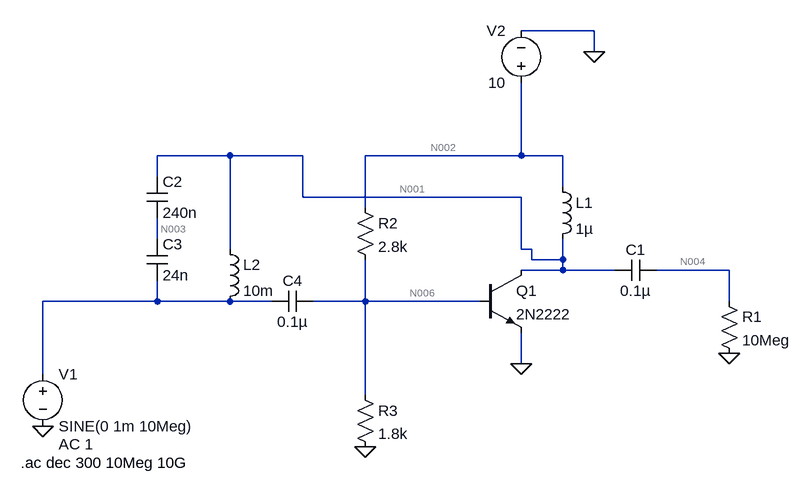
[diagram p0: schematic Draft11.asc]
Draft11.asc, the LTspice schematic file:
Version 4
SHEET 1 880 680
WIRE 336 -144 224 -144
WIRE 336 -112 336 -144
WIRE -224 48 -336 48
WIRE -112 48 -224 48
WIRE 224 48 224 -64
WIRE 224 48 -16 48
WIRE 288 48 224 48
WIRE -336 80 -336 48
WIRE 288 96 288 48
WIRE -112 112 -112 48
WIRE 224 112 -112 112
WIRE -16 128 -16 48
WIRE -336 176 -336 144
WIRE -224 192 -224 48
WIRE 224 192 224 112
WIRE 240 192 224 192
WIRE 240 208 240 192
WIRE 288 208 288 176
WIRE 288 208 240 208
WIRE 288 224 288 208
WIRE 288 224 224 224
WIRE 368 224 288 224
WIRE 544 224 432 224
WIRE -336 272 -336 240
WIRE -336 272 -512 272
WIRE -224 272 -336 272
WIRE -160 272 -224 272
WIRE -16 272 -16 208
WIRE -16 272 -96 272
WIRE 160 272 -16 272
WIRE 544 272 544 224
WIRE 224 368 224 320
WIRE -512 384 -512 272
WIRE -16 416 -16 272
FLAG 224 368 0
FLAG 544 352 0
FLAG -16 496 0
FLAG -512 464 0
FLAG 336 -112 0
SYMBOL ind 272 80 R0
SYMATTR InstName L1
SYMATTR Value 1µ
SYMBOL cap 432 208 R90
WINDOW 0 0 32 VBottom 2
WINDOW 3 32 32 VTop 2
SYMATTR InstName C1
SYMATTR Value 0.1µ
SYMBOL npn 160 224 R0
SYMATTR InstName Q1
SYMATTR Value 2N2222
SYMBOL res 528 256 R0
SYMATTR InstName R1
SYMATTR Value 10Meg
SYMBOL res -32 112 R0
SYMATTR InstName R2
SYMATTR Value 2.8k
SYMBOL res -32 400 R0
SYMATTR InstName R3
SYMATTR Value 1.8k
SYMBOL ind -240 176 R0
SYMATTR InstName L2
SYMATTR Value 10m
SYMBOL voltage -512 368 R0
WINDOW 123 24 124 Left 2
WINDOW 39 0 0 Left 0
SYMATTR InstName V1
SYMATTR Value SINE(0 1m 10Meg)
SYMATTR Value2 AC 1
SYMBOL voltage 224 -48 R180
WINDOW 0 24 96 Left 2
WINDOW 3 24 16 Left 2
WINDOW 123 0 0 Left 0
WINDOW 39 0 0 Left 0
SYMATTR InstName V2
SYMATTR Value 10
SYMBOL cap -96 256 R90
WINDOW 0 0 32 VBottom 2
WINDOW 3 32 32 VTop 2
SYMATTR InstName C4
SYMATTR Value 0.1µ
SYMBOL cap -352 80 R0
SYMATTR InstName C2
SYMATTR Value 240n
SYMBOL cap -352 176 R0
SYMATTR InstName C3
SYMATTR Value 24n
TEXT -546 520 Left 2 !.ac dec 300 10Meg 10G

The netlist it stands for:
* Draft11.asc
L1 N002 N001 1µ
C1 N004 N001 0.1µ
Q1 N001 N006 0 0 2N2222
R1 N004 0 10Meg
R2 N002 N006 2.8k
R3 N006 0 1.8k
L2 N001 N005 10m
V1 N005 0 SINE(0 1m 10Meg) AC 1
V2 N002 0 10
C4 N006 N005 0.1µ
C2 N001 N003 240n
C3 N003 N005 24n
.model NPN NPN
.model PNP PNP
.lib standard.bjt
.ac dec 300 10Meg 10G
.backanno
.end

* Results of the author's LTspice run, read from the files saved beside the schematic
* Operating Point, zero values left out:
*   V(n002) = 10 V
*   V(n001) = 5 V
*   V(n006) = 905.1 mV
*   V(n003) = 1.2 µV
*   Ic(Q1) = 294.1 mA
*   Ib(Q1) = 2.745 mA
*   Ie(Q1) = -296.8 mA
*   I(L2) = 5 kA
*   I(L1) = 5 kA
*   I(R3) = 502.8 µA
*   I(R2) = 3.248 mA
*   I(V2) = -5 kA
*   I(V1) = 5 kA
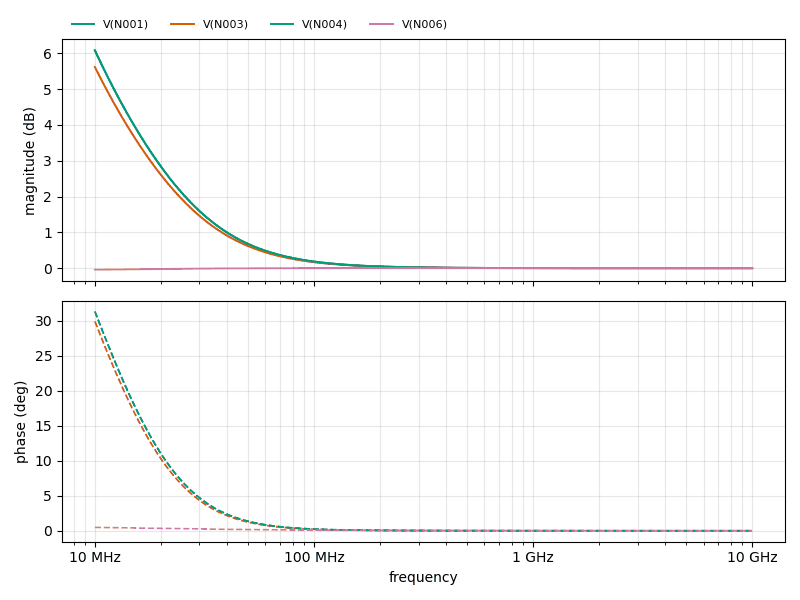
[diagram p1: AC Analysis of Draft11.asc, plotted from the saved traces]
* AC Analysis, 1 run:
*   V(N001): 6.08 dB at 10 MHz, -0.00 dB at 10 GHz, peak 6.08 dB at 10 MHz, 3 dB below the peak at 18.8 MHz
*   V(N003): 5.62 dB at 10 MHz, -0.00 dB at 10 GHz, peak 5.62 dB at 10 MHz, 3 dB below the peak at 19.99 MHz
*   V(N004): 6.08 dB at 10 MHz, -0.00 dB at 10 GHz, peak 6.08 dB at 10 MHz, 3 dB below the peak at 18.8 MHz
*   V(N006): -0.04 dB at 10 MHz, 0.00 dB at 10 GHz, peak 0.00 dB at 10 GHz